# EAGLE design Rocketometer2148 MPU6000 (EAGLE 6.2)
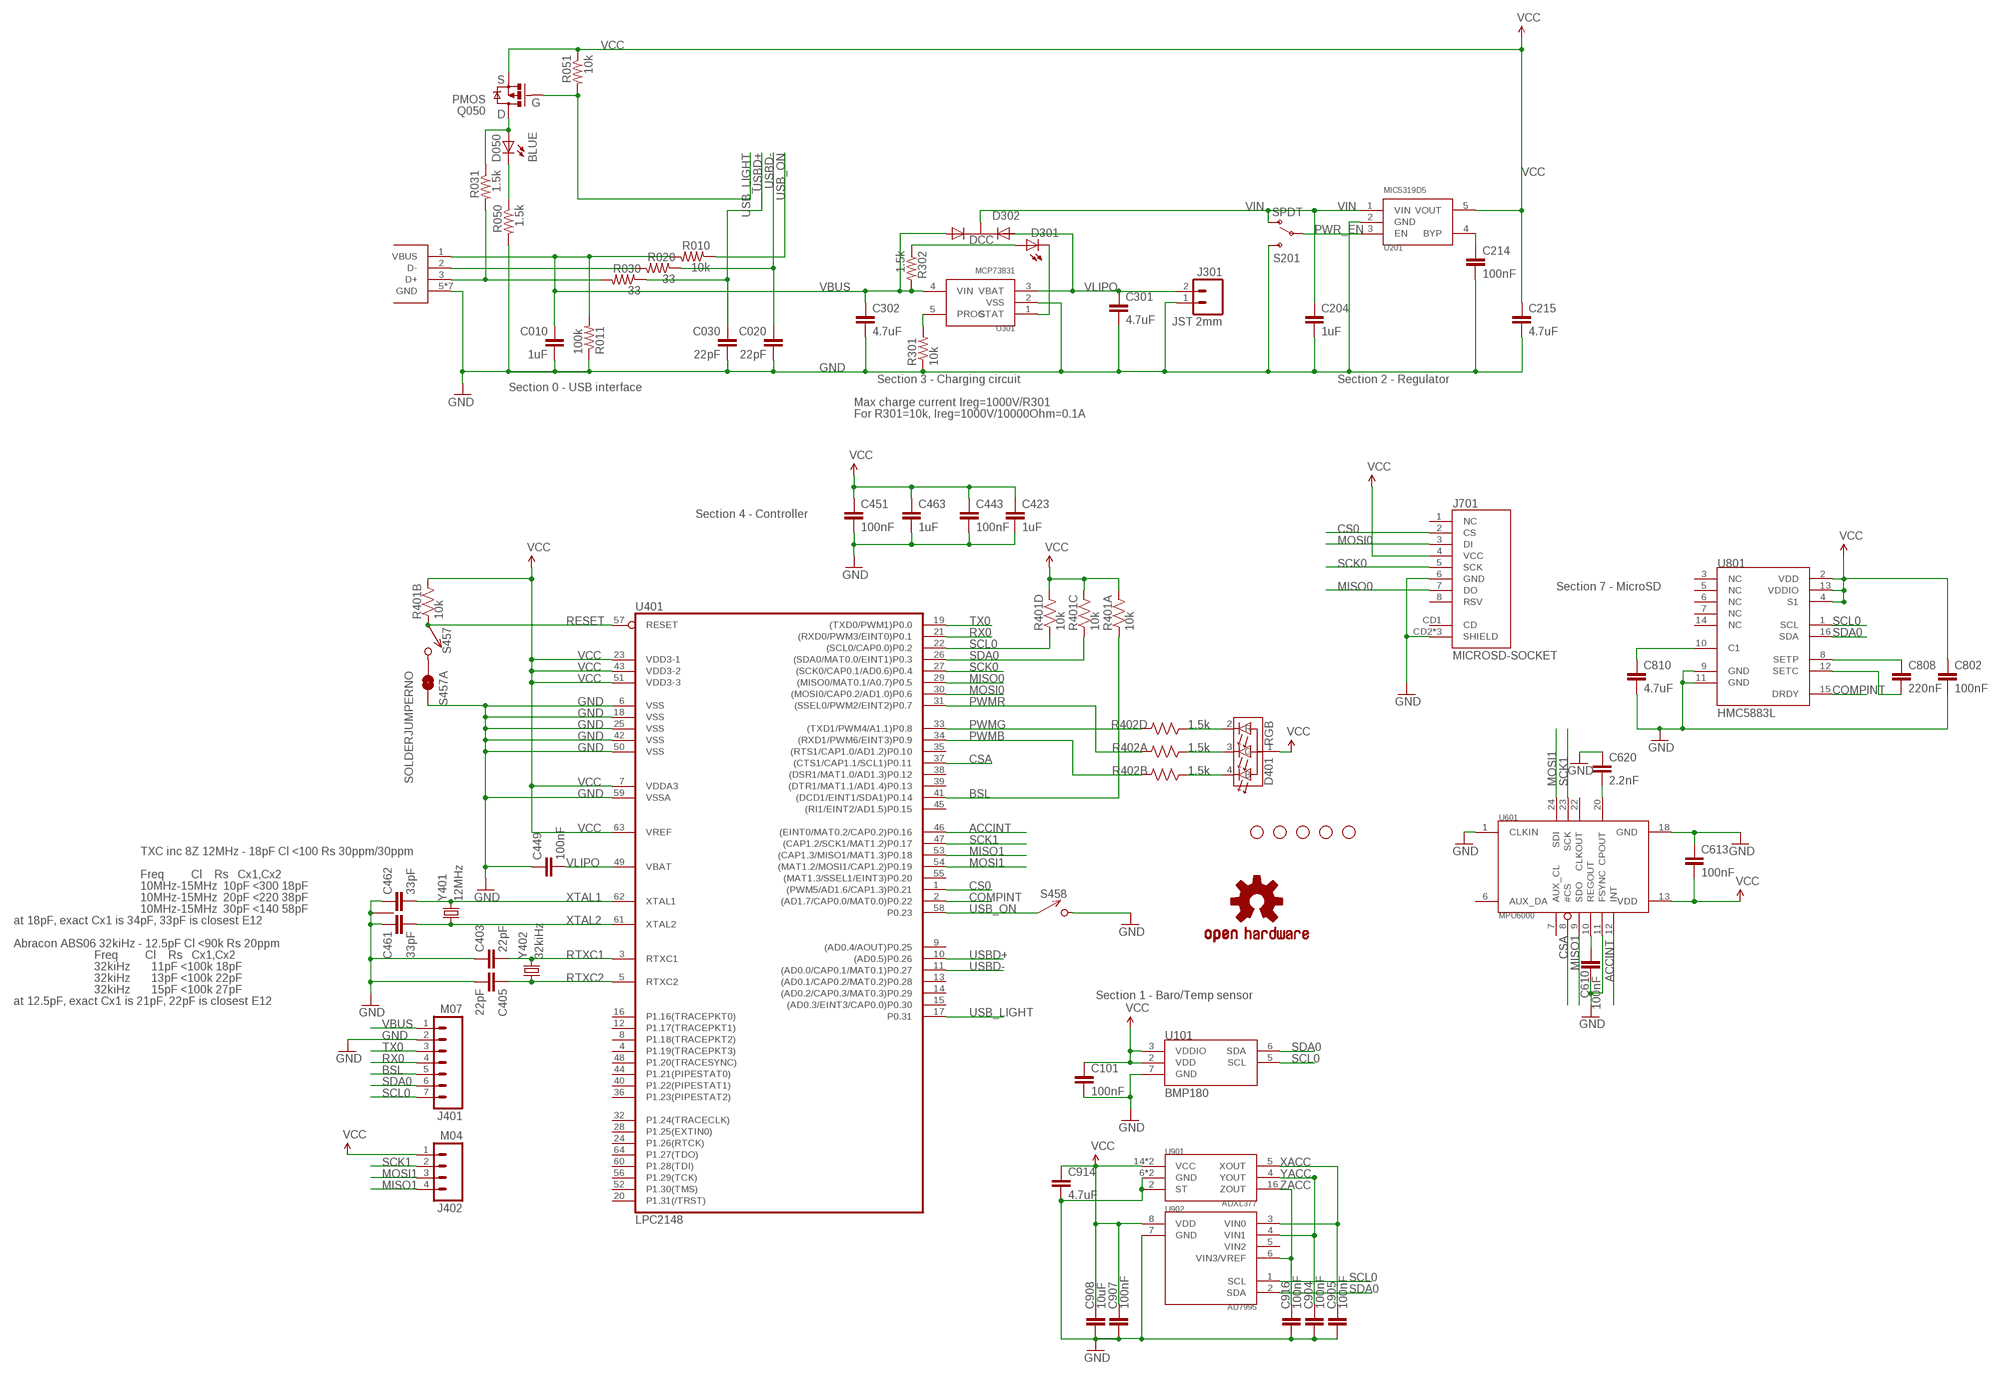
[diagram p0: schematic, sheet 1]

## Parts
C010  1uF  CAP0402-CAP  [0402-CAP]
C020  22pF  CAP0402-CAP  [0402-CAP]
C030  22pF  CAP0402-CAP  [0402-CAP]
C101  100nF  CAP0402-CAP  [0402-CAP]
C204  1uF  CAP0402-CAP  [0402-CAP]
C214  100nF  CAP0402-CAP  [0402-CAP]
C215  4.7uF  CAP0402-CAP  [0402-CAP]
C301  4.7uF  CAP0402-CAP  [0402-CAP]
C302  4.7uF  CAP0402-CAP  [0402-CAP]
C403  22pF  CAP0402-CAP  [0402-CAP]
C405  22pF  CAP0402-CAP  [0402-CAP]
C423  1uF  CAP0402-CAP  [0402-CAP]
C443  100nF  CAP0402-CAP  [0402-CAP]
C449  100nF  CAP0402-CAP  [0402-CAP]
C451  100nF  CAP0402-CAP  [0402-CAP]
C461  33pF  CAP0402-CAP  [0402-CAP]
C462  33pF  CAP0402-CAP  [0402-CAP]
C463  1uF  CAP0402-CAP  [0402-CAP]
C610  100nF  CAP0402-CAP  [0402-CAP]
C613  100nF  CAP0402-CAP  [0402-CAP]
C620  2.2nF  CAP0402-CAP  [0402-CAP]
C802  100nF  CAP0402-CAP  [0402-CAP]
C808  220nF  CAP0402-CAP  [0402-CAP]
C810  4.7uF  CAP0402-CAP  [0402-CAP]
C904  100nF  CAP0402-CAP  [0402-CAP]
C905  100nF  CAP0402-CAP  [0402-CAP]
C907  100nF  CAP0402-CAP  [0402-CAP]
C908  10uF  CAP0603-CAP  [0603-CAP]
C914  4.7uF  CAP0402-CAP  [0402-CAP]
C916  100nF  CAP0402-CAP  [0402-CAP]
D050  BLUE  LED0603  [LED-0603]
D301  YELLOW  LED0603  [LED-0603]
D302  DCC  PMEG2005CT  [SOT-23-3]
D401  RGB  HSMF-C118  [HSMF-C118]
J001  USB_MICROB_JST  [UB-MC5BR3-SD204-4S]
J301  JST 2mm  M02-JST-2MM-SMT  [JST-2-SMD]
J401  M07  [1X07]
J402  M04  M04PTH  [1X04]
J701  MICROSD-SOCKET  [MICROSD-SOCKET-PP]
JP1  STAND-OFFTIGHT  [STAND-OFF-TIGHT]
JP2  STAND-OFFTIGHT  [STAND-OFF-TIGHT]
JP3  STAND-OFFTIGHT  [STAND-OFF-TIGHT]
JP4  STAND-OFFTIGHT  [STAND-OFF-TIGHT]
JP5  STAND-OFFTIGHT  [STAND-OFF-TIGHT]
Q050  PMOS  MOSFET-PCHANNELSMD  [SOT23-3]
R010  10k  RESISTOR0402-RES  [0402-RES]
R011  100k  RESISTOR0402-RES  [0402-RES]
R020  33  RESISTOR0402-RES  [0402-RES]
R030  33  RESISTOR0402-RES  [0402-RES]
R031  1.5k  RESISTOR0402-RES  [0402-RES]
R050  1.5k  RESISTOR0402-RES  [0402-RES]
R051  10k  RESISTOR0402-RES  [0402-RES]
R301  10k  RESISTOR0402-RES  [0402-RES]
R302  1.5k  RESISTOR0402-RES  [0402-RES]
R401  10k  RP404  [CRA04]
R402  1.5k  RP404  [CRA04]
S201  SPDT  SWITCH-SPSTSMD  [AYZ0202]
S457  B3U-1000P  [B3U-1000P]
S457A  SOLDERJUMPERNO  [SJ_2S-NO]
S458  B3U-1000P  [B3U-1000P]
U101  BMP180  [BMP180]
U201  MIC5319D5  [SOT-23-5]
U301  MCP73831  [SOT-23-5]
U401  LPC2148  LPC213X  [SQFP-S-10X10-64]
U601  MPU6000  [MPU60X0]
U801  HMC5883L  HMC5883LSMD  [16LPCC]
U901  ADXL377  [ADXL377]
U902  AD7995  AD799X  [SOT-23-8]
U$2  OSHW-LOGOS  [OSHW-LOGO-S]
Y401  12MHz  CX2520  [CRYSTAL_SMD_2MM_2_5MM]
Y402  32kiHz  ABS06  [ABS06]

## Nets
ACCINT: U401.46((EINT0/MAT0.2/CAP0.2)P0.16) U601.12(INT)
BSL: J401.5 R401.1 U401.41((DCD1/EINT1/SDA1)P0.14)
COMPINT: U401.2((AD1.7/CAP0.0/MAT0.0)P0.22) U801.15(DRDY)
CONN_D+: J001.3(D+) R030.2 R031.2
CONN_D-: J001.2(D-) R020.2
CS0: J701.2(CS) U401.1((PWM5/AD1.6/CAP1.3)P0.21)
CSA: U401.37((CTS1/CAP1.1/SCL1)P0.11) U601.8(#CS)
GND [power]: C010.2 C020.2 C030.2 C101.2 C204.2 C214.2 C215.2 C301.2 C302.2 C403.1 C405.2 C423.2 C443.2 C449.1 C451.2 C461.1 C462.1 C463.2 C610.2 C613.1 C620.1 C802.2 C810.2 C904.2 C905.2 C907.2 C908.2 C914.2 C916.2 J001.5(GND) J001.P$6(GND) J001.P$7(GND) J001.P$8(GND) J001.P$9(GND) J001.P$10(GND) J001.P$11(GND) J301.1 J401.2 J701.6(GND) J701.CD2(SHIELD) J701.GND1(SHIELD) J701.GND3(SHIELD) R011.1 R050.2 R301.1 S201.3(S) S457A.2 S458.P$2 U101.7(GND) U201.2(GND) U301.2(VSS) U401.6(VSS) U401.18(VSS) U401.25(VSS) U401.42(VSS) U401.50(VSS) U401.59(VSSA) U601.1(CLKIN) U601.11(FSYNC) U601.18(GND) U801.9(GND) U801.11(GND) U901.2(ST) U901.6(GND) U901.7(GND) U902.7(GND) Y401.2 Y401.4
MISO0: J701.7(DO) U401.29((MISO0/MAT0.1/A0.7)P0.5)
MISO1: J402.4 U401.53((CAP1.3/MISO1/MAT1.3)P0.18) U601.9(SDO)
MOSI0: J701.3(DI) U401.30((MOSI0/CAP0.2/AD1.0)P0.6)
MOSI1: J402.3 U401.54((MAT1.2/MOSI1/CAP1.2)P0.19) U601.24(SDI)
N$1: C620.2 U601.20(CPOUT)
N$2: R301.2 U301.5(PROG)
N$3: D401.4(B) R402.2
N$4: D301.C U301.1(STAT)
N$5: D301.A R302.1
N$6: D050.A Q050.3(D) R031.1
N$7: D050.C R050.1
N$8: S457.P$2 S457A.1
N$9: D401.2(R) R402.4
N$11: D401.3(G) R402.1
N$13: C610.1 U601.10(REGOUT)
N$14: C808.1 U801.8(SETP)
N$15: C808.2 U801.12(SETC)
N$16: C810.1 U801.10(C1)
N$17: C214.1 U201.4(BYP)
PWMB: R402.7 U401.34((RXD1/PWM6/EINT3)P0.9)
PWMG: R402.5 U401.33((TXD1/PWM4/A1.1)P0.8)
PWMR: R402.8 U401.31((SSEL0/PWM2/EINT2)P0.7)
PWR_EN: S201.2(P) U201.3(EN)
RESET [power]: R401.2 S457.P$1 U401.57(RESET)
RTXC1: C403.2 U401.3(RTXC1) Y402.2
RTXC2: C405.1 U401.5(RTXC2) Y402.1
RX0: J401.4 U401.21((RXD0/PWM3/EINT0)P0.1)
SCK0: J701.5(SCK) U401.27((SCK0/CAP0.1/AD0.6)P0.4)
SCK1: J402.2 U401.47((CAP1.2/SCK1/MAT1.2)P0.17) U601.23(SCK)
SCL0: J401.7 R401.4 U101.5(SCL) U401.22((SCL0/CAP0.0)P0.2) U801.1(SCL) U902.1(SCL)
SDA0: J401.6 R401.3 U101.6(SDA) U401.26((SDA0/MAT0.0/EINT1)P0.3) U801.16(SDA) U902.2(SDA)
TX0: J401.3 U401.19((TXD0/PWM1)P0.0)
USB_LIGHT: Q050.1(G) R051.2 U401.17(P0.31)
USB_ON: R010.1 S458.P$1 U401.58(P0.23)
USBD+: C030.1 R030.1 U401.10((AD0.5)P0.26)
USBD-: C020.1 R020.1 U401.11((AD0.0/CAP0.1/MAT0.1)P0.27)
VBUS: C010.1 C302.1 D302.1(A1) J001.1(VBUS) J401.1 R010.2 R011.2 R302.2 U301.4(VIN)
VCC [power]: C101.1 C215.1 C423.1 C443.1 C451.1 C463.1 C613.2 C802.1 C907.1 C908.1 C914.1 D401.1(A) J402.1 J701.4(VCC) Q050.2(S) R051.1 R401.5 R401.6 R401.7 R401.8 U101.2(VDD) U101.3(VDDIO) U201.5(VOUT) U401.7(VDDA3) U401.23(VDD3-1) U401.43(VDD3-2) U401.51(VDD3-3) U401.63(VREF) U601.13(VDD) U801.2(VDD) U801.4(S1) U801.13(VDDIO) U901.14(VCC) U901.15(VCC) U902.8(VDD)
VIN: C204.1 D302.3(K) S201.1(O) U201.1(VIN)
VLIPO: C301.1 C449.2 D302.2(A2) J301.2 U301.3(VBAT) U401.49(VBAT)
XACC: C905.1 U901.5(XOUT) U902.3(VIN0)
XTAL1: C462.2 U401.62(XTAL1) Y401.3
XTAL2: C461.2 U401.61(XTAL2) Y401.1
YACC: C904.1 U901.4(YOUT) U902.4(VIN1)
ZACC: C916.1 U901.16(ZOUT) U902.6(VIN3/VREF)
Unconnected: J701.1(NC) J701.8(RSV) J701.CD1(CD) R402.3 R402.6 U401.4(P1.19(TRACEPKT3)) U401.8(P1.18(TRACEPKT2)) U401.9((AD0.4/AOUT)P0.25) U401.12(P1.17(TRACEPKT1)) U401.13((AD0.1/CAP0.2/MAT0.2)P0.28) U401.14((AD0.2/CAP0.3/MAT0.3)P0.29) U401.15((AD0.3/EINT3/CAP0.0)P0.30) U401.16(P1.16(TRACEPKT0)) U401.20(P1.31(/TRST)) U401.24(P1.26(RTCK)) U401.28(P1.25(EXTIN0)) U401.32(P1.24(TRACECLK)) U401.35((RTS1/CAP1.0/AD1.2)P0.10) U401.36(P1.23(PIPESTAT2)) U401.38((DSR1/MAT1.0/AD1.3)P0.12) U401.39((DTR1/MAT1.1/AD1.4)P0.13) U401.40(P1.22(PIPESTAT1)) U401.44(P1.21(PIPESTAT0)) U401.45((RI1/EINT2/AD1.5)P0.15) U401.48(P1.20(TRACESYNC)) U401.52(P1.30(TMS)) U401.55((MAT1.3/SSEL1/EINT3)P0.20) U401.56(P1.29(TCK)) U401.60(P1.28(TDI)) U401.64(P1.27(TDO)) U601.6(AUX_DA) U601.7(AUX_CL) U601.22(CLKOUT) U801.3(NC) U801.5(NC) U801.6(NC) U801.7(NC) U801.14(NC) U902.5(VIN2)

## Notes on the sheet
- S
- G
- D
- Section 0 - USB interface | Section 3 - Charging circuit | Section 2 - Regulator
- Max charge current Ireg=1000V/R301
- For R301=10k, Ireg=1000V/10000Ohm=0.1A
- Section 4 - Controller
- Section 7 - MicroSD
- TXC inc 8Z 12MHz - 18pF Cl <100 Rs 30ppm/30ppm
- Freq         Cl    Rs   Cx1,Cx2
- 10MHz-15MHz  10pF <300 18pF
- 10MHz-15MHz  20pF <220 38pF
- 10MHz-15MHz  30pF <140 58pF
- at 18pF, exact Cx1 is 34pF, 33pF is closest E12
- Abracon ABS06 32kiHz - 12.5pF Cl <90k Rs 20ppm
- Freq         Cl    Rs   Cx1,Cx2
- 32kiHz       11pF <100k 18pF
- 32kiHz       13pF <100k 22pF
- 32kiHz       15pF <100k 27pF
- Section 1 - Baro/Temp sensor
- at 12.5pF, exact Cx1 is 21pF, 22pF is closest E12

## Library data of the parts
C010 C204 C423 C463 = SparkFun:CAP: Capacitor Standard 0603 ceramic capacitor, and 0.1" leaded capacitor.; DIGIKEY: 445-1415-1-ND
C020 C030 C403 C405 = SparkFun:CAP: Capacitor Standard 0603 ceramic capacitor, and 0.1" leaded capacitor.; DIGIKEY: 445-5363-1-ND
C101 C214 C443 C449 C451 C610 C613 C802 C904 C905 C916 = SparkFun:CAP: Capacitor Standard 0603 ceramic capacitor, and 0.1" leaded capacitor.; DIGIKEY: 445-1268-1-ND
C215 C301 C302 C810 C914 = SparkFun:CAP: Capacitor Standard 0603 ceramic capacitor, and 0.1" leaded capacitor.; DIGIKEY: 445-7395-1-ND
C461 C462 = SparkFun:CAP: Capacitor Standard 0603 ceramic capacitor, and 0.1" leaded capacitor.; DIGIKEY: 445-1241-1-ND
C620 = SparkFun:CAP: Capacitor Standard 0603 ceramic capacitor, and 0.1" leaded capacitor.; DIGIKEY: 445-1257-1-ND
C808 = SparkFun:CAP: Capacitor Standard 0603 ceramic capacitor, and 0.1" leaded capacitor.; DIGIKEY: 445-4972-1-ND
C907 = SparkFun-Passives:CAP: Capacitor Standard 0603 ceramic capacitor, and 0.1" leaded capacitor.; DIGIKEY: 445-1268-1-ND
C908 = SparkFun:CAP: Capacitor Standard 0603 ceramic capacitor, and 0.1" leaded capacitor.; DIGIKEY: 445-7486-1-ND
D050 = SparkFun:LED: LEDs Standard schematic elements and footprints for 5mm, 3mm, 1206, and 0603 sized LEDs. 5mm - Spark Fun Electronics SKU : COM-00529 (and others); DIGIKEY: 350-2037-1-ND
D301 = SparkFun:LED: LEDs Standard schematic elements and footprints for 5mm, 3mm, 1206, and 0603 sized LEDs. 5mm - Spark Fun Electronics SKU : COM-00529 (and others); DIGIKEY: 754-1124-1-ND
D302 = KwanSystems:PMEG2005CT; DIGIKEY: 568-6500-1-ND
D401 = KwanSystems:HSMF-C118; DIGIKEY: 516-1778-1-ND
J001 = KwanSystems:USB_MICROB_JST; DIGIKEY: 455-2562-1-ND
J301 = SparkFun:M02: Header 2 Standard 2-pin 0.1" header. Use with straight break away headers (SKU : PRT-00116), right angle break away headers (PRT-00553), swiss pins (PRT-00743), machine pins (PRT-00117), and female headers (PRT-00115). Molex polarized connector foot print use with SKU : PRT-08233 with associated crimp pins and housings.; DIGIKEY: 455-1749-1-ND
J401 = SparkFun-Connectors:M07: Header 7 Standard 7-pin 0.1" header. Use with straight break away headers (SKU : PRT-00116), right angle break away headers (PRT-00553), swiss pins (PRT-00743), machine pins (PRT-00117), and female headers (PRT-00115). NOTES ON THE VARIANTS LOCK and LOCK_LONGPADS... This footprint was designed to help hold the alignment of a through-hole component (i.e. 7-pin header) while soldering it into place. You may notice that each hole has been shifted either up or down by 0.005 of an inch from it's more standard position (which is usually a perfectly straight line). This slight alteration caused the pins (the squares in the middle) to touch the edges of the holes. Because they are alternating, it causes a "brace" to hold the header in place. 0.005 has proven to be the perfect amount of "off-center" position when using our standard breakaway headers. Although looks a little odd when you look at the bare footprint, once you have a header in there, the alteration is very hard to notice. Also, if you push a header all the way into place, it is covered up entirely on the bottom side. This idea of altering the position of holes to aid alignment will be further integrated into the Sparkfun Library for other footprints. It can help hold any component with 3 or more connection pins.; DIGIKEY: $NOPART
J402 = SparkFun-Connectors:M04: Header 4 Standard 4-pin 0.1" header. Use with straight break away headers (SKU : PRT-00116), right angle break away headers (PRT-00553), swiss pins (PRT-00743), machine pins (PRT-00117), and female headers (PRT-00115). Molex polarized connector foot print use with SKU : PRT-08231 with associated crimp pins and housings. 1MM SMD Version SKU: PRT-10208; DIGIKEY: $NOPART
J701 = KwanSystems:MICROSD-SOCKET: microSD Socket Push-push type uSD socket. Digikey 101-00660-68-6-1-ND. tDoc lines correctly indicate media card edge positions when inserting (unlocked, locked, depressed).; DIGIKEY: 101-00581-59-1-ND
JP1-JP5 = SparkFun-Electromechanical:STAND-OFF: #4 Stand Off This is the mechanical footprint for a #4 phillips button head screw. Use the keepout ring to avoid running the screw head into surrounding components. SKU : PRT-00447; DIGIKEY: $NOPART
Q050 = SparkFun:MOSFET-PCHANNEL; DIGIKEY: NTR1P02T1GOSCT-ND
R010 R051 R301 = SparkFun:RESISTOR: Resistor Basic schematic elements and footprints for 0603, 1206, and PTH resistors.; DIGIKEY: P10.0KLCT-ND
R011 = SparkFun:RESISTOR: Resistor Basic schematic elements and footprints for 0603, 1206, and PTH resistors.; DIGIKEY: P100KLCT-ND
R020 R030 = SparkFun:RESISTOR: Resistor Basic schematic elements and footprints for 0603, 1206, and PTH resistors.; DIGIKEY: P33.0LCT-ND
R031 R050 R302 = SparkFun:RESISTOR: Resistor Basic schematic elements and footprints for 0603, 1206, and PTH resistors.; DIGIKEY: P1.50KLCT-ND
R401 = KwanSystems:RP4; DIGIKEY: CRA4S810KCT-ND
R402 = KwanSystems:RP4; DIGIKEY: CRA4S81.5KCT-ND
S201 = SparkFun:SWITCH-SPST: SPST Switch Simple slide switch. Spark Fun Electronics SKU : COM-00102; DIGIKEY: 401-2013-1-ND
S457 S458 = KwanSystems:B3U-1000P; DIGIKEY: SW1020CT-ND
S457A = SparkFun-Passives:SOLDERJUMPER: Solder Jumper Standard SMD solder jumper. Used to automate production. Two varients : Normally Open and Normally Closed are the same, but have different paste layers. NC will have a large amount of paste and should jumper during reflow.; DIGIKEY: $NOPART
U101 = KwanSystems:BMP180; DIGIKEY: 828-1027-1-ND
U201 = KwanSystems:MIC5319; DIGIKEY: 576-1910-1-ND
U301 = KwanSystems:MCP73831; DIGIKEY: MCP73831T-2ACI/OTCT-ND
U401 = SparkFun:LPC213X: LPC213x Schematic element and footprint for NXP LPC213x. Spark Fun Electronics SKU : COM-00520; DIGIKEY: 568-1765-ND
U601 = KwanSystems:MPU6000; DIGIKEY: $NOPART
U801 = SparkFun:HMC5883L: 3 Axis Digital Compass IC; DIGIKEY: 342-1082-1-ND; LABEL_3D50: 5883
U901 = KwanSystems:ADXL377; DIGIKEY: ADXL377BCPZ-RL7CT-ND
U902 = KwanSystems:AD799X; DIGIKEY: AD7995YRJZ-1500RL7CT-ND
U$2 = SparkFun-Aesthetics:OSHW-LOGO: Open Source Hardware Logo This logo indicates the piece of hardware it is found on incorporates a OSHW license and/or adheres to the definition of open source hardware found here: http://freedomdefined.org/OSHW; DIGIKEY: $NOPART
Y401 = KwanSystems:CX2520; DIGIKEY: 887-1487-1-ND
Y402 = KwanSystems:ABS06; DIGIKEY: 535-10104-1-ND

## Net classes
0 default: width 0.152 mm, drill 0.33 mm, clearance 0.152 mm
1 power: width 0.152 mm, drill 0.33 mm, clearance 0.152 mm to class 0, clearance 0.152 mm
2 hv: width 0.152 mm, drill 0.33 mm, clearance 0.152 mm to class 0, clearance 0.152 mm to class 1, clearance 0.152 mm

## Board
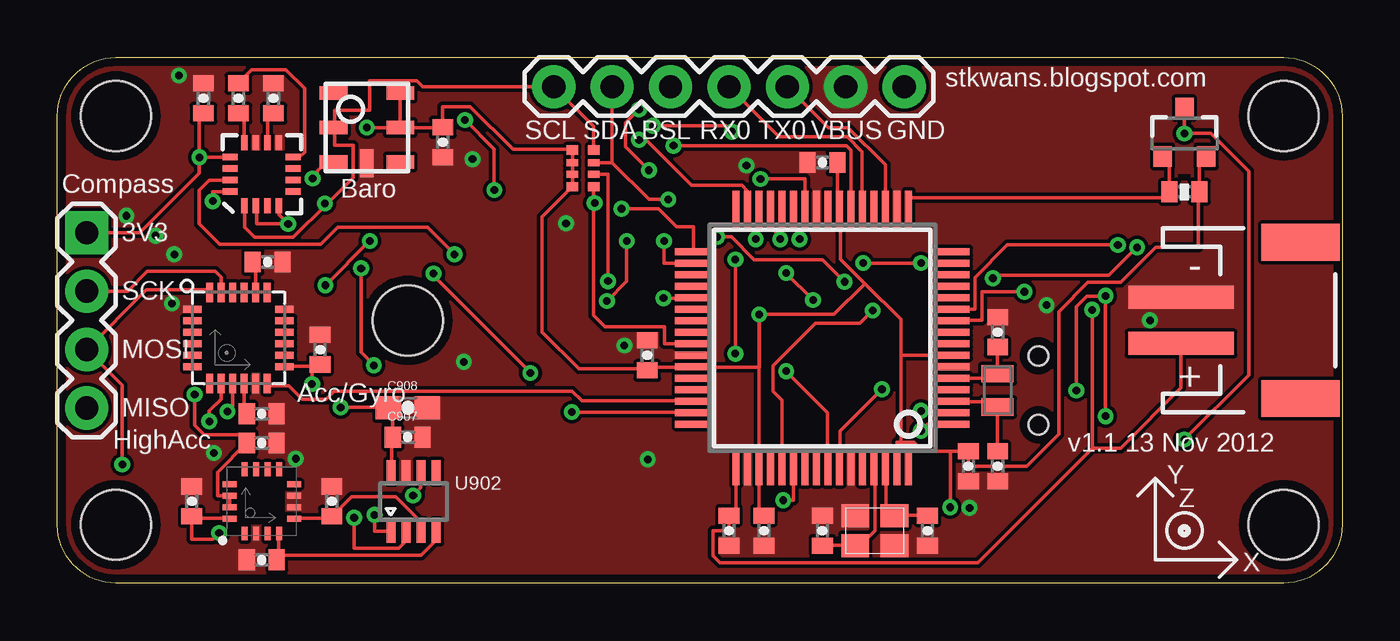
[diagram p1: board, top side]
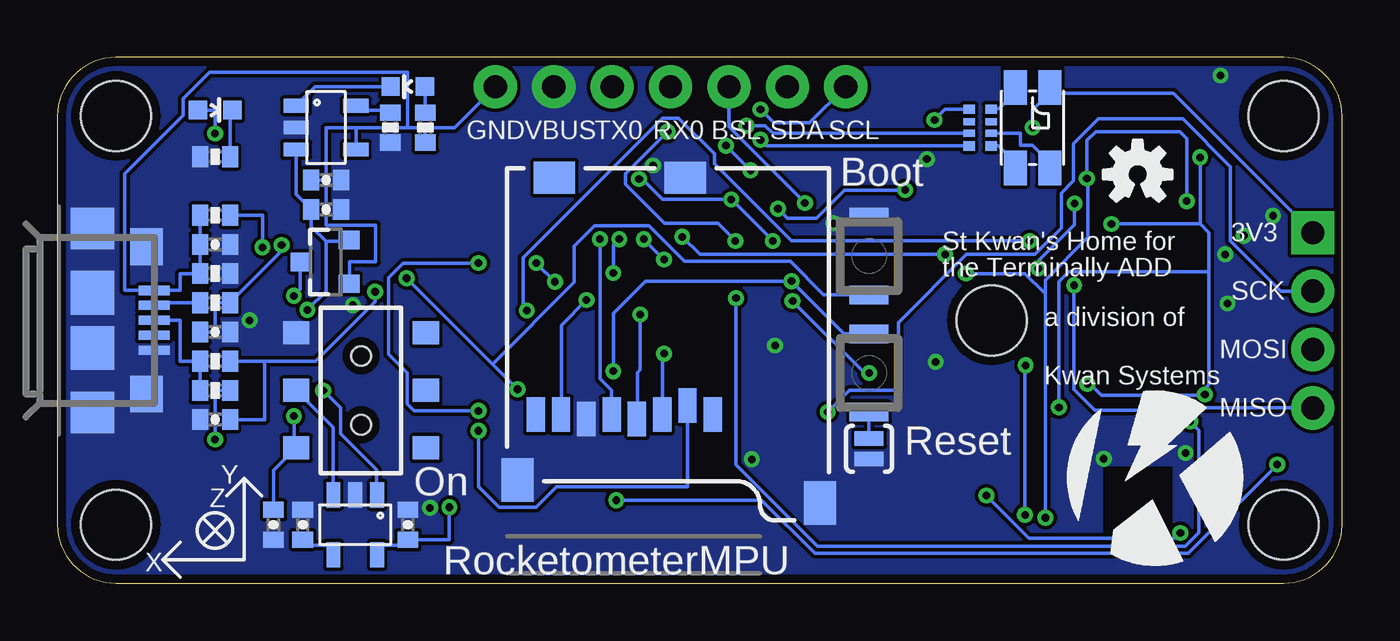
[diagram p2: board, bottom side, seen from below]

Size 55.88 x 22.86 mm. Coordinates in mm from the lower left corner, seen from the top.
Outline: 2.54,22.86 53.34,22.86 arc-90 55.88,20.32 55.88,2.54 arc-90 53.34,0 2.54,0 arc-90 0,2.54 0,20.32 arc-90 2.54,22.86
Copper layers (1*16): Top 0.0356mm / dielectric 1.5011mm / Bottom 0.0356mm
Design rules: minimum track width 6mil, minimum drill 13mil, track to track 6mil, track to pad 6mil, pad to pad 6mil, via to via 6mil, smd to smd 6mil, copper to edge 15mil, drill to drill 6mil, minimum pad ring 7mil, minimum via ring 7mil, stop-mask expansion 4mil, vias tented up to drill 14mil, thermal gap 10mil
tRestrict: area 7.9,16.8 to 9.9,18.8; area 9.9,18.8 to 10.7,19.6; area 9.9,16 to 10.7,16.8; area 7.1,18.8 to 7.9,19.6; area 7.1,16 to 7.9,16.8; area 48.8,17.5 to 49.3,17.8
bRestrict: area 7.1,16 to 10.7,19.6; area 43.8,12.6 to 43.9,13.2

### Footprints (pad centres in the part's own frame; a part is rotated, then mirrored left to right if it is on the bottom)
0402-CAP = smd 0.7 x 0.9: 1 -0.65,0; 2 0.65,0
0603-CAP = smd 1.1 x 1: 1 -0.85,0; 2 0.85,0
LED-0603 = smd 0.8 x 0.8: A 0,-0.75; C 0,0.75
SOT-23-3 = smd 0.9 x 0.8: 1 -1,0.95; 2 -1,-0.95; 3 1.1,0
HSMF-C118 = smd 1.5 x 1: 1 1.75,-0.75; 2 1.75,0.75; 3 -1.75,0.75; 4 -1.75,-0.75
UB-MC5BR3-SD204-4S = smd 0.4 x 1.35: 1 -1.3,2.675; 2 -0.65,2.675; 3 0,2.675; 4 0.65,2.675; 5 1.3,2.675 | smd 1.8 x 1.9: P$6 4,0; P$7 -4,0 | smd 1.9 x 1.9: P$8 -1.2,0; P$9 1.2,0 | smd 1.6 x 1.4: P$10 -3.2,2.35; P$11 3.2,2.35
JST-2-SMD = smd 1 x 4.6: 1 -1,-3.7; 2 1,-3.7 | smd 1.6 x 3.4: NC1 -3.4,1.5; NC2 3.4,1.5
1X07 = drill 1.016 pad 1.88: 1 0,0; 2 2.54,0; 3 5.08,0; 4 7.62,0; 5 10.16,0; 6 12.7,0; 7 15.24,0
1X04 = drill 1.016 pad 1.88 square: 1 0,0 | drill 1.016 pad 1.88: 2 2.54,0; 3 5.08,0; 4 7.62,0
MICROSD-SOCKET-PP = smd 0.8 x 1.5: 1 -8.94,10.7; 2 -7.84,10.3; 3 -6.74,10.7; 4 -5.64,10.9; 5 -4.54,10.7; 6 -3.44,10.9; 7 -2.34,10.7; 8 -1.24,10.7 | smd 1.8 x 1.4: CD1 -2.05,0.4; CD2 -7.75,0.4 | smd 1.4 x 1.9: GND1 -13.6,14.55; GND3 -0.45,13.55
STAND-OFF-TIGHT = hole 3.048: 0,0
SOT23-3 = smd 0.8 x 0.9: 1 -0.95,-1; 2 0.95,-1; 3 0,1.1
0402-RES = smd 0.7 x 0.9: 1 -0.65,0; 2 0.65,0
CRA04 = smd 0.4 x 0.5: 1 -0.8,-0.475; 4 0.8,-0.475; 5 0.8,0.475; 8 -0.8,0.475 | smd 0.3 x 0.5: 2 -0.25,-0.475; 3 0.25,-0.475; 6 0.25,0.475; 7 -0.25,0.475
AYZ0202 = smd 1 x 1.15: 1 -2.5,2.825; 2 0,2.825; 3 2.5,2.825; 4 -2.5,-2.825; 5 0,-2.825; 6 2.5,-2.825 | hole 0.85: 1.5,0; -1.5,0
B3U-1000P = smd 0.8 x 1.7: P$1 -1.7,0; P$2 1.7,0
SJ_2S-NO = smd 0.635 x 1.27: 1 -0.45,0; 2 0.45,0
BMP180 = smd 0.6 x 1.2: 1 1.5,1.45; 2 0,1.45; 3 -1.5,1.45; 4 -1.5,-1.45; 5 0,-1.45; 6 1.5,-1.45 | smd 1.2 x 0.6: 7 1.55,0
SOT-23-5 = smd 0.6 x 1.1: 1 -0.95,-1.3; 2 0,-1.3; 3 0.95,-1.3; 4 0.95,1.3; 5 -0.95,1.3
SQFP-S-10X10-64 = smd 0.3 x 1.6: 1 -3.75,-5.6; 2 -3.25,-5.6; 3 -2.75,-5.6; 4 -2.25,-5.6; 5 -1.75,-5.6; 6 -1.25,-5.6; 7 -0.75,-5.6; 8 -0.25,-5.6; 9 0.25,-5.6; 10 0.75,-5.6; 11 1.25,-5.6; 12 1.75,-5.6; 13 2.25,-5.6; 14 2.75,-5.6; 15 3.25,-5.6; 16 3.75,-5.6; 33 3.75,5.6; 34 3.25,5.6; 35 2.75,5.6; 36 2.25,5.6; 37 1.75,5.6; 38 1.25,5.6; 39 0.75,5.6; 40 0.25,5.6; 41 -0.25,5.6; 42 -0.75,5.6; 43 -1.25,5.6; 44 -1.75,5.6; 45 -2.25,5.6; 46 -2.75,5.6; 47 -3.25,5.6; 48 -3.75,5.6 | smd 1.6 x 0.3: 17 5.6,-3.75; 18 5.6,-3.25; 19 5.6,-2.75; 20 5.6,-2.25; 21 5.6,-1.75; 22 5.6,-1.25; 23 5.6,-0.75; 24 5.6,-0.25; 25 5.6,0.25; 26 5.6,0.75; 27 5.6,1.25; 28 5.6,1.75; 29 5.6,2.25; 30 5.6,2.75; 31 5.6,3.25; 32 5.6,3.75; 49 -5.6,3.75; 50 -5.6,3.25; 51 -5.6,2.75; 52 -5.6,2.25; 53 -5.6,1.75; 54 -5.6,1.25; 55 -5.6,0.75; 56 -5.6,0.25; 57 -5.6,-0.25; 58 -5.6,-0.75; 59 -5.6,-1.25; 60 -5.6,-1.75; 61 -5.6,-2.25; 62 -5.6,-2.75; 63 -5.6,-3.25; 64 -5.6,-3.75
MPU60X0 = smd 0.8 x 0.3: 1 -2,1.25; 2 -2,0.75; 3 -2,0.25; 4 -2,-0.25; 5 -2,-0.75; 6 -2,-1.25; 13 2,-1.25; 14 2,-0.75; 15 2,-0.25; 16 2,0.25; 17 2,0.75; 18 2,1.25 | smd 0.3 x 0.85: 7 -1.25,-1.975; 8 -0.75,-1.975; 9 -0.25,-1.975; 10 0.25,-1.975; 11 0.75,-1.975; 12 1.25,-1.975; 19 1.25,1.975; 20 0.75,1.975; 21 0.25,1.975; 22 -0.25,1.975; 23 -0.75,1.975; 24 -1.25,1.975
16LPCC = smd 0.65 x 0.28: 1 -1.37,0.75; 2 -1.37,0.25; 3 -1.37,-0.25; 4 -1.37,-0.75; 9 1.37,-0.75; 10 1.37,-0.25; 11 1.37,0.25; 12 1.37,0.75 | smd 0.28 x 0.65: 5 -0.75,-1.37; 6 -0.25,-1.37; 7 0.25,-1.37; 8 0.75,-1.37; 13 0.75,1.37; 14 0.25,1.37; 15 -0.25,1.37; 16 -0.75,1.37
ADXL377 = smd 0.6 x 0.25: 1 -1.4,0.75; 2 -1.4,0.25; 3 -1.4,-0.25; 4 -1.4,-0.75; 9 1.4,-0.75; 10 1.4,-0.25; 11 1.4,0.25; 12 1.4,0.75 | smd 0.25 x 0.6: 5 -0.75,-1.4; 6 -0.25,-1.4; 7 0.25,-1.4; 8 0.75,-1.4; 13 0.75,1.4; 14 0.25,1.4; 15 -0.25,1.4; 16 -0.75,1.4
SOT-23-8 = smd 0.4 x 1: 1 -0.975,-1.3; 2 -0.325,-1.3; 3 0.325,-1.3; 4 0.975,-1.3; 5 0.975,1.3; 6 0.325,1.3; 7 -0.325,1.3; 8 -0.975,1.3
CRYSTAL_SMD_2MM_2_5MM = smd 1.2 x 1: 1 -0.85,-0.65; 2 0.85,-0.65; 3 0.85,0.65; 4 -0.85,0.65
ABS06 = smd 0.75 x 1.4: 1 -0.725,0; 2 0.725,0

### Placement (x,y rotation side)
C010  49.02,14.73 0 bottom
C020  49.02,10.92 0 bottom
C030  49.02,7.11 180 bottom
C101  16.76,19.18 270 top
C204  46.48,2.54 270 bottom
C214  45.21,2.54 90 bottom
C215  40.64,2.54 90 bottom
C301  44.2,16.26 0 bottom
C302  44.2,17.53 0 bottom
C403  40.89,5.08 90 top
C405  40.89,10.92 90 top
C423  33.27,18.29 180 top
C443  25.65,9.91 90 top
C449  29.21,2.29 90 top
C451  30.73,2.29 270 top
C461  33.27,2.29 270 top
C462  37.85,2.29 90 top
C463  39.62,5.08 270 top
C610  8.89,7.37 0 top
C613  11.43,10.16 270 top
C620  9.14,13.97 180 top
C802  6.35,21.08 90 top
C808  7.87,21.08 270 top
C810  9.4,21.08 90 top
C904  8.89,1.02 180 top
C905  11.94,3.56 90 top
C907  15.24,6.35 0 top
C908  15.24,7.62 0 top
C914  8.89,6.1 0 top
C916  5.84,3.56 90 top
D050  49.02,20.57 270 bottom
D301  40.64,21.59 90 bottom
D302  44.2,13.97 180 bottom
D401  13.46,19.81 90 bottom
J001  54.36,11.43 270 bottom
J301  52.58,11.43 270 top
J401  36.83,21.59 180 top
J402  1.27,15.24 270 top
J701  36.31,18.03 180 bottom
JP1  2.54,2.54 0 top
JP2  2.54,20.32 0 top
JP3  15.24,11.43 0 top
JP4  53.34,2.54 0 top
JP5  53.34,20.32 0 top
Q050  49.02,19.56 0 top
R010  49.02,16 180 bottom
R011  49.02,13.46 180 bottom
R020  49.02,12.19 180 bottom
R030  49.02,9.65 180 bottom
R031  49.02,8.38 180 bottom
R050  49.02,18.54 180 bottom
R051  49.02,17.02 180 top
R301  41.4,19.81 90 bottom
R302  39.88,19.81 270 bottom
R401  22.86,18.03 90 top
R402  15.75,19.81 90 bottom
S201  42.67,8.38 90 bottom
S457  20.57,9.14 270 bottom
S457A  20.57,5.84 270 bottom
S458  20.57,14.22 90 bottom
U101  13.46,19.81 270 top
U201  42.93,2.54 180 bottom
U301  44.2,19.81 270 bottom
U401  33.27,10.67 90 top
U601  7.87,10.67 0 top
U801  8.89,17.78 90 top
U901  8.89,3.56 90 top
U902  15.49,3.56 0 top
U$1  [KWAN_CIRCLE]  8.13,4.57 0 bottom
U$2  8.89,17.78 0 bottom
U$4  [AXES]  47.75,1.02 0 top
Y401  35.56,2.29 0 top
Y402  40.89,8.38 270 top

### Tracks (layer width: path | path; a pad name or v marks a point on that pad's centre or on a via)
ACCINT
  Top 0.152: U601.12 9.14,8.69 9.25,8.59 10.06,8.59 10.64,8 11.68,8 12.04,8.36 22.38,8.36 22.81,7.92 U401.46
BSL  (via drill 0.33)
  Top 0.152: 23.32,16.54 23.32,11.66 23.82,11.15 26.42,11.15 26.42,10.42 U401.41 | 23.32,16.54 23.32,17.22 R401.1 | v23.37,16.54 23.32,16.54
  Bottom 0.152: J401.5 26.67,19.84 v23.37,16.54
COMPINT  (via drill 0.33)
  Top 0.152: v17.27,14.3 16.1,15.47 12.19,15.47 11.46,14.73 7.06,14.73 6.17,15.62 6.17,17.09 6.6,17.53 U801.15 | v28.7,15.06 29.31,15.06 30.3,14.07 33.27,14.07 v34.24,13.11 | v37.57,13.92 v35.05,13.92 | U401.2 37.57,7.42 v37.57,7.49
  Bottom 0.152: v17.27,14.3 27.94,14.3 v28.7,15.06 | v35.05,13.92 v34.24,13.11 | v37.57,13.92 40.84,13.92 41.48,13.28 41.48,9.96 40.66,9.14 40.66,7.8 40.36,7.49 v37.57,7.49
CONN_D+
  Bottom 0.152: R031.2 49.68,8.38 49.68,9.65 R030.2 50.55,9.65 50.55,11.43 J001.3
CONN_D-
  Bottom 0.152: R020.2 51.56,12.19 51.66,12.09 J001.2
CS0  (via drill 0.33)
  Top 0.152: U401.1 37.85,6.91 v37.57,6.63
  Bottom 0.152: v37.57,6.63 37.57,4.19 36.68,3.3 35.05,3.3 34.16,4.19 28.47,4.19 J701.2
CSA  (via drill 0.33)
  Top 0.152: v6.6,7.04 6.6,7.49 7.11,8 U601.8 | v26.36,12.39 27.66,12.39 U401.37
  Bottom 0.152: v26.36,12.39 26.36,5.16 22.81,1.6 6.81,1.6 6.22,2.18 6.22,6.66 v6.6,7.04
GND  (via drill 0.33)
  other vias: 3,15.98 4.27,15.11 5.08,14.3 4.98,12.17 18.06,18.44 6.81,5.66 10.36,5.41 29.97,18.16 24.66,10.34 43.03,12.09 47.52,11.43 39.67,3.28 25.68,5.38 17.68,9.63 5.28,22.07 22.12,15.65
  pour Bottom (no thermals): 2.54,22.86 53.34,22.86 arc-90 55.88,20.32 55.88,2.54 arc-90 53.34,0 2.54,0 arc-90 0,2.54 0,20.32 arc-90
  pour Top (no thermals): 2.54,22.86 53.34,22.86 arc-90 55.88,20.32 55.88,2.54 arc-90 53.34,0 2.54,0 arc-90 0,2.54 0,20.32 arc-90
MISO0  (via drill 0.33)
  Top 0.152: v31.7,13.49 v32.87,12.32 | v31.45,14.96 31.45,15.06 31.04,15.47 31.04,16.26 U401.29
  Bottom 0.152: v32.87,12.32 33.96,11.23 J701.7 | v31.7,13.49 31.7,14.71 v31.45,14.96
MISO1  (via drill 0.33)
  Top 0.152: v7.39,7.47 7.62,7.7 U601.9 | v11.66,12.95 v13.59,14.88 | U401.53 31.52,7.95 31.11,8.36 31.11,9.45 32.97,11.3 34.9,11.3 v35.46,11.86
  Bottom 0.152: J402.4 6.83,7.62 6.99,7.47 v7.39,7.47 7.44,7.52 10.74,7.52 11.66,8.43 v11.66,12.95 | v13.59,14.88 23.95,14.88 27.3,18.24 27.3,18.67 28.85,20.22 29.57,20.22 35.64,14.15 35.64,12.04 v35.46,11.86
MOSI0  (via drill 0.33)
  Top 0.152: v29.49,14.07 v29.49,9.98 | v30.38,14.96 30.38,15.34 30.5,15.47 30.5,16.26 U401.30
  Bottom 0.152: v29.49,9.98 29.57,9.91 J701.3 | v30.38,14.96 v29.49,14.07
MOSI1  (via drill 0.33)
  Top 0.152: U601.24 6.6,12.65 6.5,12.75 3.86,12.75 J402.3 2.82,8.61 v2.82,5.16 | U401.54 32.02,3.61 v31.57,3.61
  Bottom 0.152: v31.57,3.61 25.25,3.61 22.94,1.29 6.68,1.29 v2.82,5.16
N$1
  Top 0.152: U601.20 8.61,13.87 8.51,13.97 C620.2
N$2
  Bottom 0.152: 41.4,20.47 R301.2 41.4,20.57 42.67,20.57 42.67,20.75 42.88,20.75 U301.5
N$3
  Bottom 0.152: R402.2 13.99,19.56 13.99,19.05 13.46,19.05 12.72,18.31 12.72,18.09 D401.4
N$4
  Bottom 0.152: D301.C 44.68,21.59 45.49,20.78 U301.1
N$5
  Bottom 0.152: R302.1 39.88,21.59 D301.A
N$6  (via drill 0.33)
  Top 0.152: Q050.3 v49.02,19.56 50.16,19.56 51.82,17.91 51.82,9.04 v49.02,6.25
  Bottom 0.152: v49.02,6.25 49.02,8.38 R031.1 48.39,8.38 | D050.A 49.02,20.57 v49.02,19.56
N$7
  Bottom 0.152: R050.1 48.37,20.47 D050.C
N$8
  Bottom 0.152: S457.P$2 S457A.1
N$9
  Bottom 0.152: R402.4 15.27,20.62 14.94,20.62 14.61,20.95 14.61,21.17 D401.2 14.22,21.54
N$11
  Bottom 0.152: 15.27,19 R402.1 14.95,19.01 14.61,18.67 14.61,18.45 D401.3
N$13
  Top 0.152: U601.10 8.13,7.47 C610.1
N$14
  Top 0.152: U801.8 10.26,18.54 10.54,18.54 10.74,18.75 10.74,21.51 9.93,22.33 8.46,22.33 7.87,21.74 C808.1
N$15
  Top 0.152: U801.12 8.13,19.15 8.13,20.17 C808.2
N$16
  Top 0.152: U801.10 9.14,20.17 C810.1
N$17
  Bottom 0.152: C214.1 C214.1 arc-90 44.97,1.65 43.88,1.65 U201.4
PWMB  (via drill 0.33)
  Top 0.152: 26.39,14.43 v26.39,14.88 26.39,13.92 U401.34 | v29.34,19.63 29.08,19.89 v25.91,19.89
  Bottom 0.152: v25.91,19.89 25.09,19.89 24.77,19.56 16.23,19.56 R402.7 | v29.34,19.63 31.17,17.8 31.17,17.35 29.46,15.65 27.15,15.65 v26.39,14.88
PWMG  (via drill 0.33)
  Top 0.152: v24.54,16.28 26.14,16.28 26.92,15.49 27.67,15.49 U401.33 | v17.73,20.14 19,18.87 v19,17.09
  Bottom 0.152: v17.73,20.14 17.27,20.6 16.23,20.6 R402.5 | v24.54,16.28 24.13,15.88 22.86,15.88 21.64,17.09 v19,17.09
PWMR  (via drill 0.33)
  Top 0.152: v25.3,19.28 25.6,19.28 27.58,17.3 29.77,17.3 30.02,17.04 U401.31
  Bottom 0.152: v25.3,19.28 25.04,19.02 16.23,19.02 R402.8
PWR_EN
  Bottom 0.152: U201.3 43.89,3.86 43.89,6.78 S201.2
RESET  (via drill 0.33)
  Top 0.152: v23.95,13.13 23.95,17.78 R401.2 | v31.7,9.22 33.5,7.42 33.5,5.08 U401.57
  Bottom 0.152: S457.P$1 21.66,10.84 v23.95,13.13 30.3,13.13 31.7,11.73 v31.7,9.22
RTXC1
  Top 0.152: C403.2 40.89,7.39 40.64,7.64 Y402.2 40.59,7.7 40.39,7.9 38.89,7.9 U401.3
RTXC2
  Top 0.152: 40.64,9.09 Y402.1 | U401.5 40.45,8.92 arc90 Y402.1 | C405.1 40.89,9.36 arc-90 Y402.1
RX0
  Top 0.152: U401.21 35,16.28 35,18.77 34.37,19.41 31.39,19.41 J401.4
SCK0  (via drill 0.33)
  Top 0.152: v32.28,14.96 32.28,15.21 32.03,15.47 32.03,16.26 U401.27
  Bottom 0.152: v32.28,14.96 32.28,8.89 31.77,8.38 J701.5
SCK1  (via drill 0.33)
  Top 0.152: U601.23 7.11,13.31 6.86,13.56 3.91,13.56 3.05,12.7 J402.2 | v22.38,7.44 27.66,7.44 U401.47
  Bottom 0.152: J402.2 2.67,12.7 4.85,14.88 4.85,18.11 6.93,20.19 10.59,20.19 11.68,19.1 11.68,17.5 12.22,16.97 12.22,15.44 13.36,14.3 16.33,14.3 19.3,11.33 19.3,8.38 21.44,8.38 v22.38,7.44
SCL0  (via drill 0.33)
  Top 0.152: R401.4 23.32,18.85 23.32,19.86 J401.7 15.88,21.59 15.62,21.84 13.59,21.84 13.59,20.57 12.06,20.57 12.06,19.81 | v26.8,19.02 34.31,19.02 34.52,18.82 U401.22 | 11.71,16.48 12.85,17.63 12.85,19.05 12.06,19.05 12.06,19.81 | 11.71,16.48 10.26,15.04 8.59,15.04 8.15,15.47 8.15,16.41 U801.1 | U101.5 12.06,19.81 | v13.21,13.69 13.21,10.03 v13.77,9.47 | v25.3,20.6 24.71,20.02 24.71,18.97 v25.73,17.96 | U902.1 13.79,2.26 v13.79,2.97 | v11.63,16.51 11.68,16.51 11.71,16.48
  Bottom 0.152: v25.73,17.96 v26.8,19.02 | v13.79,2.97 13.79,9.25 13.77,9.25 v13.77,9.47 | v13.21,13.69 13.21,14.02 11.63,15.6 v11.63,16.51 | J401.7 23.16,20.02 24.71,20.02 v25.3,20.6
SDA0  (via drill 0.33)
  Top 0.152: J401.6 24.13,18.28 | v30.58,17.58 32.52,17.58 U401.26 | v11.1,17.6 11.3,17.6 11.3,17.91 11.71,18.31 U101.6 11.99,18.29 | 7.52,17.02 U801.16 6.76,17.03 v6.76,16.61 | U902.2 15.16,2.23 15.16,1.85 14.83,1.52 12.9,1.52 v12.9,2.85 | v24.77,14.88 24.77,13.13 v23.9,12.27 | 24.13,18.28 R401.3 | v26.57,16.69 25.73,16.69 24.13,18.28 | v16.36,13.46 16.36,13.36 v20.57,9.14
  Bottom 0.152: v30.58,17.58 30.45,17.58 29.57,16.69 v26.57,16.69 v24.77,14.88 | v6.76,16.61 6.76,19.33 7.06,19.63 10.72,19.63 11.1,19.25 v11.1,17.6 11.05,17.55 11.05,15.04 12.9,13.18 12.9,12.62 | 12.9,12.62 v12.9,2.85 | v16.36,13.46 13.79,13.46 12.95,12.62 12.9,12.62 | v20.57,9.14 20.78,9.14 v23.9,12.27
TX0
  Top 0.152: U401.19 36.02,18.19 34.39,19.81 33.53,19.81 J401.3
USB_LIGHT
  Top 0.152: R051.2 48.36,18.26 48.08,18.54 Q050.1 | 48.31,16.97 R051.2 | U401.17 37.02,16.76 48.12,16.76 arc90 R051.2
USB_ON  (via drill 0.33)
  Top 0.152: v40.69,13.26 40.82,13.39 45.74,13.39 v46.97,14.61 | U401.58 34.04,5.08 34.04,6.6 v35.87,8.43
  Bottom 0.152: v35.87,8.43 36.96,9.53 | 36.96,9.53 v40.69,13.26 | 36.96,9.53 33.4,13.08 33.4,14.66 32.51,15.54 30.15,15.54 28.6,13.99 24,13.99 22.55,12.55 20.57,12.55 S458.P$1 | R010.1 46.97,16 v46.97,14.61
USBD+  (via drill 0.33)
  Top 0.152: v42.06,12.68 40.21,12.68 40.21,11.43 38.89,11.43 U401.10
  Bottom 0.152: C030.1 46.86,7.11 46.86,9.65 | v42.06,12.68 42.06,12.24 44.65,9.65 46.86,9.65 | R030.1 46.86,9.65
USBD-  (via drill 0.33)
  Top 0.152: v46.13,14.71 41.33,14.71 39.9,13.28 39.9,11.92 U401.11
  Bottom 0.152: 48.39,12.19 R020.1 | v46.13,14.71 46.13,14.45 48.34,12.24 R020.1 | C020.1 49.02,10.92 49.02,12.19 R020.1
VBUS
  Bottom 0.152: 44.2,17.53 44.2,15.57 42.04,15.57 42.04,13.97 43.18,13.97 43.18,13.23 43.38,13.03 D302.1 | 44.83,17.53 C302.1 44.2,17.53 | R011.2 49.68,13.46 49.68,14.73 C010.1 49.68,14.78 49.68,16 R010.2 | 49.73,13.41 R011.2 | 39.88,19.18 R302.2 | 39.83,19.23 R302.2 | R011.2 50.55,13.46 50.55,12.73 J001.1 52.96,12.73 52.96,17.8 50.42,20.34 50.42,21.06 49.25,22.23 40.64,22.23 40.64,19.81 | 40.64,19.81 39.88,19.81 | 39.88,19.81 R302.2 | 44.2,17.53 44.2,19.81 42.93,19.81 | 42.93,19.81 40.64,19.81 | U301.4 42.9,19.78 42.93,19.81 | J401.1 38.61,19.81 39.88,19.81
VCC  (via drill 0.33)
  Top 0.152: 38.84,5.74 37.64,5.74 37.26,6.12 36.68,6.12 | 38.84,5.74 C463.1 39.62,5.08 42.16,5.08 43.56,6.48 43.56,11.81 44.83,13.08 46.25,13.08 47.78,14.61 49.63,14.61 49.63,16.97 R051.1 49.68,17.02 49.68,18.26 49.96,18.54 Q050.2 | 36.68,6.12 36.52,6.12 U401.63 | 38.84,5.74 v38.84,3.3 | C423.1 33.93,18.29 33.93,16.36 U401.23 34.06,16.2 34.06,14.1 35.13,13.03 | 38.89,9.93 U401.7 38.86,9.91 36.68,9.91 | 35.13,13.03 36.68,11.48 36.68,9.91 | U902.8 14.53,4.88 14.53,6.3 C907.1 14.58,7.44 14.4,7.62 C908.1 14.33,7.64 v12.32,7.64 | U901.15 7.49,3.33 7.49,3.79 U901.14 6.96,3.81 6.96,4.82 C914.1 | 8.23,6.02 C914.1 | U601.13 9.88,9.42 11.35,9.42 C613.2 11.07,9.37 v11.07,8.66 | U801.2 8.66,16.41 8.66,15.62 v10.03,15.62 9.64,16.01 U801.4 9.63,16.41 | 7.52,18.54 U801.13 v6.17,18.53 v6.17,18.52 | v5.97,8.2 5.97,6.86 6.38,6.45 8.24,6.45 C914.1 | J402.1 3.58,15.24 6.17,17.83 v6.17,18.52 | 25.65,9.27 C443.1 | R401.8 22.4,17.25 22.4,17.78 R401.7 22.4,17.86 22.4,18.26 R401.6 22.4,18.34 22.4,18.82 R401.5 22.33,18.87 19.81,18.87 17.96,20.73 16.76,20.73 C101.1 | U101.2 16.76,19.81 C101.1 | 16.64,19.86 C101.1 | U101.3 U101.2 | 14.91,19.86 U101.2 | C443.1 25.6,9.32 22.68,9.32 21.08,10.92 21.08,15.93 R401.8 | 22.45,17.2 R401.8 | 30.79,3 C451.1 30.52,2.94 U401.51 | C443.1 25.8,9.4 27.66,9.4 U401.43 27.74,9.4 30.53,9.4 v30.53,11.68 | U401.51 | C802.1 6.17,20.25 v6.17,18.52 | 36.68,6.12 36.68,9.91 | U101.2 v13.46,19.81 | U401.51 v30.52,11.68 v30.53,11.68 | v30.53,11.68 33.78,11.68 35.13,13.03
  Bottom 0.152: C215.1 40.87,1.65 41.98,1.65 U201.5 41.96,1.25 | 40.59,1.93 C215.1 | 6.17,15.62 v10.03,15.62 | v11.07,8.66 10.95,8.66 10.46,8.18 6.25,8.18 6.1,8.33 | 6.1,8.33 5.79,8.64 5.79,13.54 | 5.79,13.54 5.79,15.24 6.17,15.62 | 6.1,8.33 v5.97,8.2 | v12.32,7.64 12.32,13.11 11.89,13.54 5.79,13.54 | J701.4 30.66,7.14 30.66,9.14 30.53,9.27 30.53,11.18 v30.53,11.68 | 12.72,21.36 12.72,21.54 D401.1 | D401.1 12.68,21.31 7.34,21.31 J402.1 | 6.17,15.62 v6.17,18.52 | v13.46,19.81 13.46,20.57 13.08,20.95 13.08,21.19 D401.1 | v38.84,3.3 38.84,1.89 C215.1
VIN  (via drill 0.33)
  Top 0.152: v45.59,7.26 v45.59,12.5 45.54,12.47 44.78,12.47 44.32,12.01 v44.32,8.38
  Bottom 0.152: C204.1 46.48,4.9 45.52,5.87 S201.1 45.59,5.89 v45.59,7.26 | v45.59,12.5 45.31,12.78 45.31,13.97 D302.3 | U201.1 41.99,3.86 41.99,4.93 43.56,6.5 43.56,7.62 v44.32,8.38
VLIPO  (via drill 0.33)
  Top 0.152: 29.18,2.74 29.18,2.87 C449.2 | 48.87,10.41 J301.2 48.88,8.49 46.25,5.87 45.01,5.87 | 45.01,5.87 v45.01,11.89 | U401.49 29.52,2.94 C449.2 | 45.01,5.87 40.03,0.89 28.83,0.89 28.52,1.19 28.52,2.29 29.21,2.29 C449.2
  Bottom 0.152: 44.78,16.2 44.83,16.26 C301.1 | D302.2 43.26,14.86 44.2,14.86 | U301.3 45.49,18.85 45.49,16.92 44.88,16.31 C301.1 | v45.01,11.89 44.2,12.7 44.2,14.86 | 44.2,14.86 44.85,15.51 C301.1
XACC
  Top 0.152: U901.5 10.31,2.82 11.86,2.82 11.94,2.9 C905.1 11.99,2.95 12.8,3.76 14.71,3.76 15.8,2.67 15.8,2.26 U902.3
XTAL1
  Top 0.152: C462.2 36.42,2.95 Y401.3 36.4,3.02 36.04,3.38 36.04,5.05 U401.62
XTAL2
  Top 0.152: C461.2 33.27,1.65 34.7,1.65 Y401.1 | 34.87,1.68 34.77,1.68 Y401.1 | 35.53,5.05 U401.61 arc-90 35.56,5.03 35.56,2.29 34.91,1.64 Y401.1
YACC
  Top 0.152: U901.4 9.63,2.13 9.63,1.09 C904.1 9.68,1.22 15.82,1.22 16.46,1.85 16.46,2.23 U902.4
ZACC  (via drill 0.33)
  Top 0.152: U901.16 7.47,2.82 5.92,2.82 5.84,2.9 C916.1 5.84,1.91 6.76,1.91 v7.04,2.18 | v15.47,3.81 15.8,4.14 15.8,4.85 U902.6
  Bottom 0.152: v15.47,3.81 13.61,1.96 7.26,1.96 v7.04,2.18

### Text on the board
tPlace: stkwans.blogspot.com | SCL | SDA | BSL | RX0 | TX0 | VBUS | GND | Compass | Baro | 3V3 | - | SCK | MOSI | + | Acc/Gyro | MISO | HighAcc | v1.1 13 Nov 2012
bPlace: SCL | SDA | BSL | RX0 | TX0 | VBUS | GND | Boot | 3V3 | St Kwan's Home for | the Terminally ADD | SCK | a division of | MOSI | Kwan Systems | MISO | Reset | On | RocketometerMPU
bDocu: D